# EasyEDA Pro project Card Reader 3.0.0.eprj

# Schematic Schematic1

## Sheets
1 P1: Create Date: 2026-01-15; Page Name: P1; Project Name: Project Name; Schematic Name: Schematic Name; Update Date: 2021.11.05; Company: EasyEDA.com; Page Size: A4; Version: V1.0
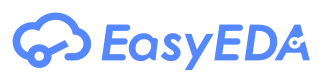
[diagram p0: P1]
2 NFC Reader: Board Name: Board1; Page Name: NFC Reader; Project Name: Card Reader 3.0.0; Schematic Name: Schematic1; Update Date: 2026-01-15
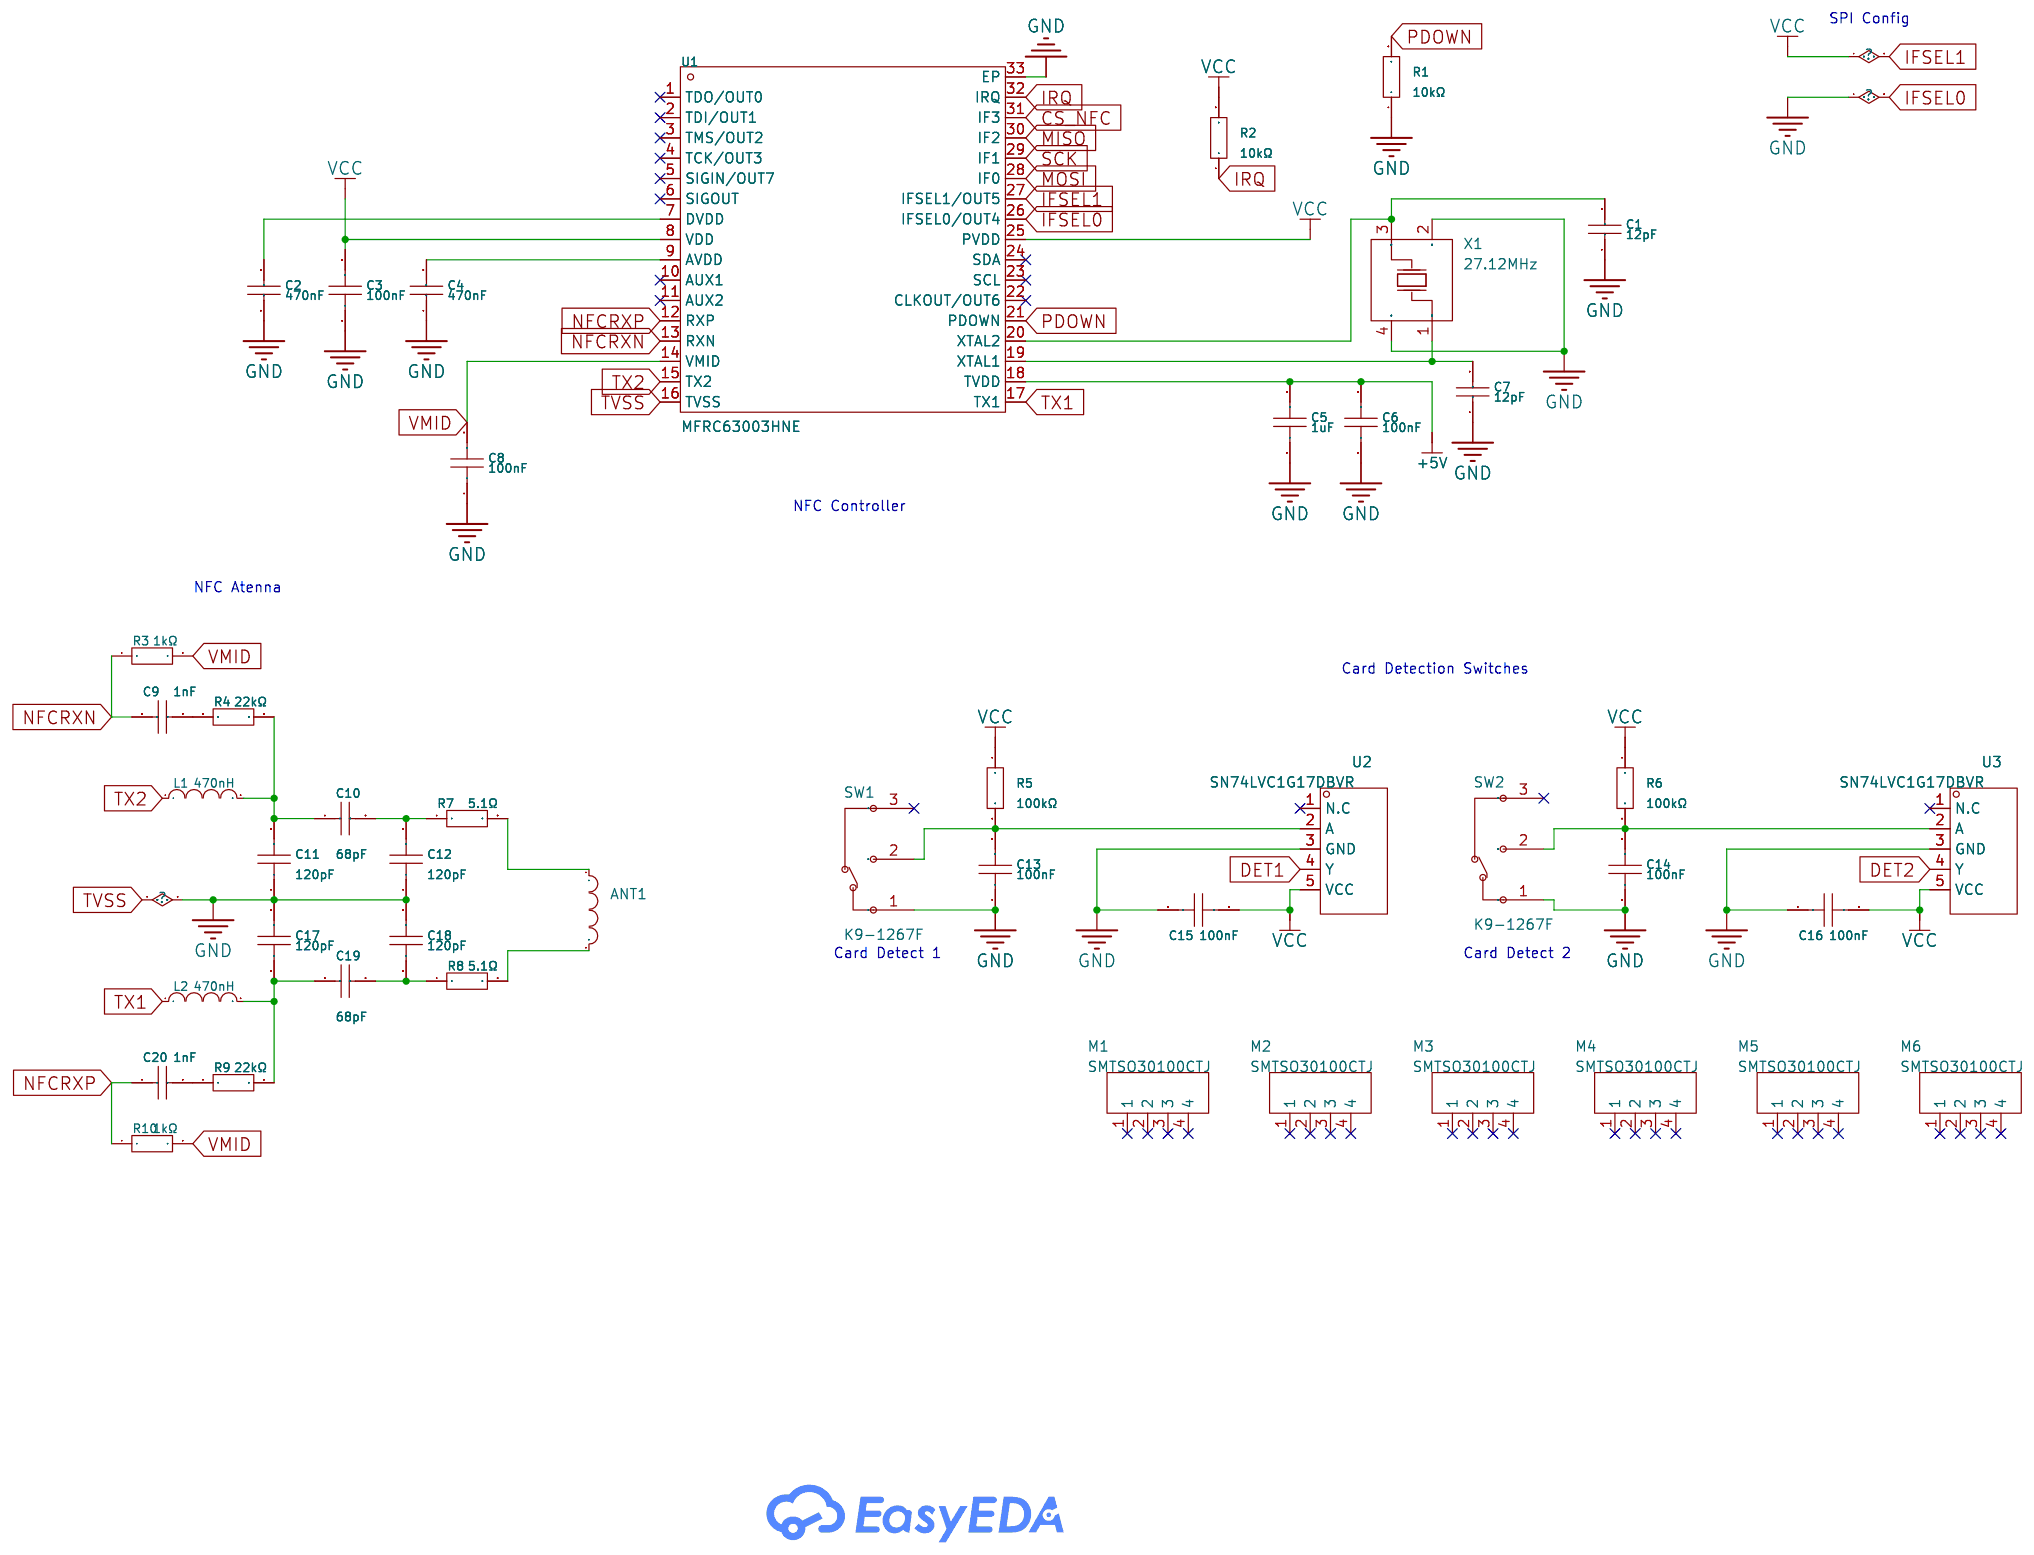
[diagram p1: NFC Reader]
3 LEDs
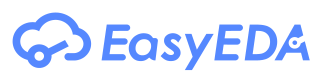
[diagram p2: LEDs]
4 Interfaces
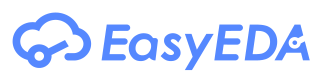
[diagram p3: Interfaces]

## Parts
ANT1  -  [NFC Antenna Footprint]
C1  12pF  [C0603]
C2  470nF  [C0603]
C3  100nF  [C0603]
C4  470nF  [C0603]
C5  1uF  [C0603]
C6  100nF  [C0603]
C7  12pF  [C0603]
C8  100nF  [C0603]
C9  1nF  [C0603]
C10  68pF  [C0603]
C11  120pF  [C0603]
C12  120pF  [C0603]
C13  100nF  [C0603]
C14  100nF  [C0603]
C15  100nF  [C0603]
C16  100nF  [C0603]
C17  120pF  [C0603]
C18  120pF  [C0603]
C19  68pF  [C0603]
C20  1nF  [C0603]
L1  470nH  [L0603]
L2  470nH  [L0603]
M1  SMTSO30100CTJ  [SCREW-SMD_BD5.6-D4.1-H10]
M2  SMTSO30100CTJ  [SCREW-SMD_BD5.6-D4.1-H10]
M3  SMTSO30100CTJ  [SCREW-SMD_BD5.6-D4.1-H10]
M4  SMTSO30100CTJ  [SCREW-SMD_BD5.6-D4.1-H10]
M5  SMTSO30100CTJ  [SCREW-SMD_BD5.6-D4.1-H10]
M6  SMTSO30100CTJ  [SCREW-SMD_BD5.6-D4.1-H10]
R1  10kΩ  [R0603]
R2  10kΩ  [R0603]
R3  1kΩ  [R0603]
R4  22kΩ  [R0603]
R5  100kΩ  [R0603]
R6  100kΩ  [R0603]
R7  5.1Ω  [R0603]
R8  5.1Ω  [R0603]
R9  22kΩ  [R0603]
R10  1kΩ  [R0603]
SW1  K9-1267F  [SW-TH_K9-1267F]
SW2  K9-1267F  [SW-TH_K9-1267F]
U1  MFRC63003HNE  [HVQFN-32_L5.0-W5.0-P0.50-TL-EP3.1]
U2  SN74LVC1G17DBVR  [SOT-23-5_L3.0-W1.7-P0.95-LS2.8-BR]
U3  SN74LVC1G17DBVR  [SOT-23-5_L3.0-W1.7-P0.95-LS2.8-BR]
X1  27.12MHz  [CRYSTAL-SMD_4P-L3.2-W2.5-BL-1]

## Library data of the parts
ANT1 = NFC Antenna: 40x54mm, 1270um track, 508um gap, 35um track thickness, 4 turn, 1.66 turn exponent, NXP calls it a 1445nH, 2.4pF, 0.95R antenna.
C1 C7 = CL10C120JB8NNNC: Capacitance: Tolerance:±5% Tolerance:±5% Voltage Rated: Temperature Coefficient:; LCSC Part Name: 12pF ±5% 50V; Supplier Part: C38523; Manufacturer: SAMSUNG(三星); Supplier Footprint: 0603; JLCPCB Part Class: Basic Part; Datasheet: https://atta.szlcsc.com/upload/public/pdf/source/20160218/1457707763339.pdf; Supplier: LCSC; Tolerance: ±5%
C2 C4 = CL10B474KA8NNNC: Capacitance: Tolerance:±10% Tolerance:±10% Voltage Rated: Temperature Coefficient:; LCSC Part Name: 470nF ±10% 25V; Supplier Part: C1623; Manufacturer: SAMSUNG(三星); Supplier Footprint: 0603; JLCPCB Part Class: Basic Part; Datasheet: https://atta.szlcsc.com/upload/public/pdf/source/20160218/1457707763339.pdf; Supplier: LCSC; Tolerance: ±10%
C3 C6 C8 C13-C16 = CC0603KRX7R9BB104: Capacitance: Tolerance:±10% Tolerance:±10% Voltage Rated: Temperature Coefficient:; LCSC Part Name: 100nF ±10% 50V; Supplier Part: C14663; Manufacturer: YAGEO(国巨); Supplier Footprint: 0603; JLCPCB Part Class: Basic Part; Datasheet: https://atta.szlcsc.com/upload/public/pdf/source/20180910/C282072_33301C7F631E79921B82A8DAC6BCC5B3.pdf; Supplier: LCSC; Tolerance: ±10%
C5 = CL10A105KB8NNNC: Capacitance: Tolerance:±10% Tolerance:±10% Voltage Rated: Temperature Coefficient:; LCSC Part Name: 1uF ±10% 50V; Supplier Part: C15849; Manufacturer: SAMSUNG(三星); Supplier Footprint: 0603; JLCPCB Part Class: Basic Part; Datasheet: https://atta.szlcsc.com/upload/public/pdf/source/20160218/1457707763339.pdf; Supplier: LCSC; Tolerance: ±10%
C9 C20 = CL10B102KB8NNNC: Capacitance: Tolerance:±10% Tolerance:±10% Voltage Rated: Temperature Coefficient:; LCSC Part Name: 1nF ±10% 50V; Supplier Part: C1588; Manufacturer: SAMSUNG(三星); Supplier Footprint: 0603; JLCPCB Part Class: Basic Part; Datasheet: https://atta.szlcsc.com/upload/public/pdf/source/20160218/1457707763339.pdf; Supplier: LCSC; Tolerance: ±10%
C10 C19 = CL10C680JB8NNNC: Capacitance: Tolerance:±5% Tolerance:±5% Voltage Rated: Temperature Coefficient:; LCSC Part Name: 68pF ±5% 50V; Supplier Part: C28262; Manufacturer: SAMSUNG(三星); Supplier Footprint: 0603; JLCPCB Part Class: Extended Part; Datasheet: https://atta.szlcsc.com/upload/public/pdf/source/20160218/1457707763339.pdf; Supplier: LCSC; Tolerance: ±5%
C11 C12 C17 C18 = CL10C121JB8NNNC: Capacitance: Tolerance:±5% Tolerance:±5% Voltage Rated: Temperature Coefficient:; LCSC Part Name: 120pF ±5% 50V; Supplier Part: C18438; Manufacturer: SAMSUNG(三星); Supplier Footprint: 0603; JLCPCB Part Class: Extended Part; Datasheet: https://atta.szlcsc.com/upload/public/pdf/source/20160218/1457707763339.pdf; Supplier: LCSC; Tolerance: ±5%
L1 L2 = MLP1608VR47DT0S1: Inductance: Tolerance:±20% Tolerance:±20% Rated Current: Saturation Current (Isat):- DC Resistance (DCR): Q @ Freq:- Frequency - Self Resonant:- Ratings:; LCSC Part Name: 470nH ±20%; Supplier Part: C105533; Manufacturer: TDK; Supplier Footprint: 0603; Datasheet: https://atta.szlcsc.com/upload/public/pdf/source/20180702/C105533_29B6B2DE07EC923A72FED272F110324B.pdf; Supplier: LCSC; Tolerance: ±20%
M1-M6 = SMTSO30100CTJ: specifications:M3X10 surface treatment:镀锡 Product Description:- material quality:- model:SMTSO30100CTJ brand:Sinhoo(雄和远景); LCSC Part Name: 雄和远景，电路板表贴圆螺母柱，M3X10，铜镀锡,1个; Supplier Part: C2916370; Manufacturer: Sinhoo(雄和远景); JLCPCB Part Class: Extended Part; Datasheet: https://atta.szlcsc.com/upload/public/pdf/source/20211122/17CF5E24EB4D4DC090A80DE3D7DE5E21.pdf; Supplier: LCSC; specifications: M3X10; surface treatment: 镀锡; brand: Sinhoo(雄和远景)
R1 R2 = 0603WAF1002T5E: Type:Thick Film Resistors Resistance:10kΩ Tolerance:±1% Tolerance:±1% Power(Watts): Overload Voltage (Max): Temperature Coefficient:±100ppm/℃ Temperature Coefficient:±100ppm/℃ Operating Temperature Range:-55℃~+155℃ Operating Temperature Range:-55℃~+155℃; LCSC Part Name: 厚膜电阻 10kΩ ±1% 100mW; Supplier Part: C25804; Manufacturer: UNI-ROYAL(厚声); Supplier Footprint: 0603; JLCPCB Part Class: Basic Part; Datasheet: https://atta.szlcsc.com/upload/public/pdf/source/20200306/C422600_1E6D84923E4A46A82E41ADD87F860B5C.pdf; Supplier: LCSC; Type: Thick Film Resistors; Tolerance: ±1%; Temperature Coefficient: ±100ppm/℃; Operating Temperature Range: -55℃~+155℃
R3 R10 = 0603WAF1001T5E: Type:Thick Film Resistors Resistance:1kΩ Tolerance:±1% Tolerance:±1% Power(Watts): Overload Voltage (Max): Temperature Coefficient:±100ppm/℃ Temperature Coefficient:±100ppm/℃ Operating Temperature Range:-55℃~+155℃ Operating Temperature Range:-55℃~+155℃; LCSC Part Name: 1kΩ ±1% 100mW 厚膜电阻; Supplier Part: C21190; Manufacturer: UNI-ROYAL(厚声); Supplier Footprint: 0603; JLCPCB Part Class: Basic Part; Datasheet: https://atta.szlcsc.com/upload/public/pdf/source/20200306/C422600_1E6D84923E4A46A82E41ADD87F860B5C.pdf; Supplier: LCSC; Type: Thick Film Resistors; Tolerance: ±1%; Temperature Coefficient: ±100ppm/℃; Operating Temperature Range: -55℃~+155℃
R4 R9 = 0603WAF2202T5E: Type:Thick Film Resistors Resistance:22kΩ Tolerance:±1% Tolerance:±1% Power(Watts): Overload Voltage (Max): Temperature Coefficient:±100ppm/℃ Temperature Coefficient:±100ppm/℃ Operating Temperature Range:-55℃~+155℃ Operating Temperature Range:-55℃~+155℃; LCSC Part Name: 22kΩ ±1% 100mW 厚膜电阻; Supplier Part: C31850; Manufacturer: UNI-ROYAL(厚声); Supplier Footprint: 0603; Datasheet: https://atta.szlcsc.com/upload/public/pdf/source/20200306/C422600_1E6D84923E4A46A82E41ADD87F860B5C.pdf; Supplier: LCSC; Type: Thick Film Resistors; Tolerance: ±1%; Temperature Coefficient: ±100ppm/℃; Operating Temperature Range: -55℃~+155℃
R5 R6 = 0603WAF1003T5E: Type:Thick Film Resistor Resistance:100kΩ Tolerance:±1% Tolerance:±1% Power(Watts):100mW Voltage-Supply(Max):75V Temperature Coefficient:±100ppm/℃ Temperature Coefficient:±100ppm/℃ Operating Temperature:-55℃~+155℃ Operating Temperature:-55℃~+155℃; LCSC Part Name: 100kΩ ±1% 100mW 厚膜电阻; Supplier Part: C25803; Manufacturer: UNI-ROYAL(厚声); Supplier Footprint: 0603; JLCPCB Part Class: Basic Part; Datasheet: https://item.szlcsc.com/datasheet/0603WAF1003T5E/26546.html; Supplier: LCSC; Type: Thick Film Resistor; Tolerance: ±1%; Power(Watts): 100mW; Voltage-Supply(Max): 75V; Temperature Coefficient: ±100ppm/℃; Operating Temperature: -55℃~+155℃; Operating Temperature Range: -55℃~+155℃
R7 R8 = 0603WAF510KT5E: Type:Thick Film Resistors Resistance:5.1Ω Tolerance:±1% Tolerance:±1% Power(Watts): Overload Voltage (Max): Temperature Coefficient:±200ppm/℃ Temperature Coefficient:±200ppm/℃ Operating Temperature Range:-55℃~+155℃ Operating Temperature Range:-55℃~+155℃; LCSC Part Name: 5.1Ω ±1% 100mW 厚膜电阻; Supplier Part: C25197; Manufacturer: UNI-ROYAL(厚声); Supplier Footprint: 0603; JLCPCB Part Class: Basic Part; Datasheet: https://atta.szlcsc.com/upload/public/pdf/source/20200306/C422600_1E6D84923E4A46A82E41ADD87F860B5C.pdf; Supplier: LCSC; Type: Thick Film Resistors; Tolerance: ±1%; Temperature Coefficient: ±200ppm/℃; Operating Temperature Range: -55℃~+155℃
SW1 SW2 = K9-1267F: Type:Micro Switch Circuit:SPDT Switch Length:12.7mm Switch Width:5.7mm Switch Height:12.8mm Contact Current (DC):100mA Voltage Rating (DC):30V Contact Current (AC):1A Voltage Rating (AC):125V Mechanical Life:300万次 Operating Temperature:-25℃~+85℃ Operating; LCSC Part Name: 12.7*5.7*12.8mm 插件微动开关; Supplier Part: C107263; Manufacturer: 韩国韩荣; Supplier Footprint: 插件; JLCPCB Part Class: Extended Part; Datasheet: https://atta.szlcsc.com/upload/public/pdf/source/20201214/C107263_D9656DE761E5BF43078859A56D7E33A8.pdf; Supplier: LCSC; Type: Micro Switch; Circuit: SPDT; Switch Length: 12.7mm; Switch Width: 5.7mm; Switch Height: 12.8mm; Contact Current (DC): 100mA; Voltage Rating (DC): 30V; Contact Current (AC): 1A; Voltage Rating (AC): 125V; Mechanical Life: 300万次; Operating Temperature: -25℃~+85℃
U1 = MFRC63003HNE: Supplier Part: C1526298; Manufacturer: NXP(恩智浦); Supplier Footprint: HVQFN-32-EP(5x5); JLCPCB Part Class: Extended Part; Datasheet: https://atta.szlcsc.com/upload/public/pdf/source/20230811/188CF1E38A54086FF38BC20E6B5F5B97.pdf; Supplier: LCSC
U2 U3 = SN74LVC1G17DBVR: Input type:Schmitt Trigger output type:推挽 Supply Voltage:1.65V~5.5V Supply Voltage:1.65V~5.5V Number of Elements:1 Number of Bits per Element:1 Sink Current:32mA Source Current:32mA Logic Family:74LVC Operating Temperature:-40℃~+125℃ Operating Temperature; Supplier Part: C7836; Manufacturer: TI(德州仪器); Supplier Footprint: SOT-23-5; JLCPCB Part Class: Extended Part; Datasheet: https://www.ti.com/cn/lit/gpn/sn74lvc1g17; Supplier: LCSC; Input type: Schmitt Trigger; output type: 推挽; Supply Voltage: 1.65V~5.5V; Number of Elements: 1; Number of Bits per Element: 1; Sink Current: 32mA; Source Current: 32mA; Logic Family: 74LVC; Operating Temperature: -40℃~+125℃; NO_CONNECT: yes
X1 = X32252712MMB4SI: Crystal Type:Surface Mount Crystal Frequency: Normal temperature Frequency Tolerance:±10ppm Normal temperature Frequency Tolerance:±10ppm Load Capacitance: Frequency Stability:±20ppm Frequency Stability:±20ppm Operating Temperature: Operating Temperature:; LCSC Part Name: 27.12MHz ±10ppm 10pF; Supplier Part: C29975; Manufacturer: YXC(扬兴晶振); Supplier Footprint: SMD3225-4P; JLCPCB Part Class: Extended Part; Datasheet: https://atta.szlcsc.com/upload/public/pdf/source/20240329/19D5F850207469550BEB00D7DFEDBC7A.pdf; Supplier: LCSC; Crystal Type: Surface Mount Crystal; Normal temperature Frequency Tolerance: ±10ppm; Frequency Stability: ±20ppm

## Nets
+5V: C5.2 C6.2 U1.18(TVDD)
GND: C1.1 C2.2 C3.1 C4.1 C5.1 C6.1 C7.1 C8.1 C11.1 C12.1 C13.1 C14.1 C15.1 C16.1 C17.2 C18.2 R1.1 SW1.1(C) SW2.1(C) U1.16(TVSS) U1.26(IFSEL0/OUT4) U1.33(EP) U2.3(GND) U3.3(GND) X1.2(GND) X1.4(GND)
VCC: C3.2 C15.2 C16.2 R2.2 R5.1 R6.1 U1.8(VDD) U1.25(PVDD) U1.27(IFSEL1/OUT5) U2.5(VCC) U3.5(VCC)
CS_NFC: U1.31(IF3)
DET1: U2.4(Y)
DET2: U3.4(Y)
IRQ: R2.1 U1.32(IRQ)
MISO: U1.30(IF2)
MOSI: U1.28(IF0)
NFCRXN: C9.1 R3.1 U1.13(RXN)
NFCRXP: C20.1 R10.1 U1.12(RXP)
PDOWN: R1.2 U1.21(PDOWN)
SCK: U1.29(IF1)
TX1: L2.1 U1.17(TX1)
TX2: L1.1 U1.15(TX2)
VMID: C8.2 R3.2 R10.2 U1.14(VMID)
Net-(ANT1-1): ANT1.1 R7.2
Net-(ANT1-2): ANT1.2 R8.2
Net-(C1-2): C1.2 U1.20(XTAL2) X1.3(OSC2)
Net-(C2-1): C2.1 U1.7(DVDD)
Net-(C4-2): C4.2 U1.9(AVDD)
Net-(C7-2): C7.2 U1.19(XTAL1) X1.1(OSC1)
Net-(C9-2): C9.2 R4.1
Net-(C10-1): C10.1 C11.2 L1.2 R4.2
Net-(C10-2): C10.2 C12.2 R7.1
Net-(C13-2): C13.2 R5.2 SW1.2(NO) U2.2(A)
Net-(C14-2): C14.2 R6.2 SW2.2(NO) U3.2(A)
Net-(C17-1): C17.1 C19.1 L2.2 R9.2
Net-(C18-1): C18.1 C19.2 R8.1
Net-(C20-2): C20.2 R9.1

Not connected (* = marked no-connect by the designer): M1 1* 2* 3* 4*; M2 1* 2* 3* 4*; M3 1* 2* 3* 4*; M4 1* 2* 3* 4*; M5 1* 2* 3* 4*; M6 1* 2* 3* 4*; SW1 3(NC)*; SW2 3(NC)*; U1 1(TDO/OUT0)* 2(TDI/OUT1)* 3(TMS/OUT2)* 4(TCK/OUT3)* 5(SIGIN/OUT7)* 6(SIGOUT)* 10(AUX1)* 11(AUX2)* 22(CLKOUT/OUT6)* 23(SCL)* 24(SDA)*; U2 1(N.C)*; U3 1(N.C)*

## Notes on the sheets
sheet 2
- SPI Config
- NFC Controller
- NFC Atenna
- Card Detection Switches
- Card Detect 1
- Card Detect 2
